# Altium project LED Project.PrjPcb
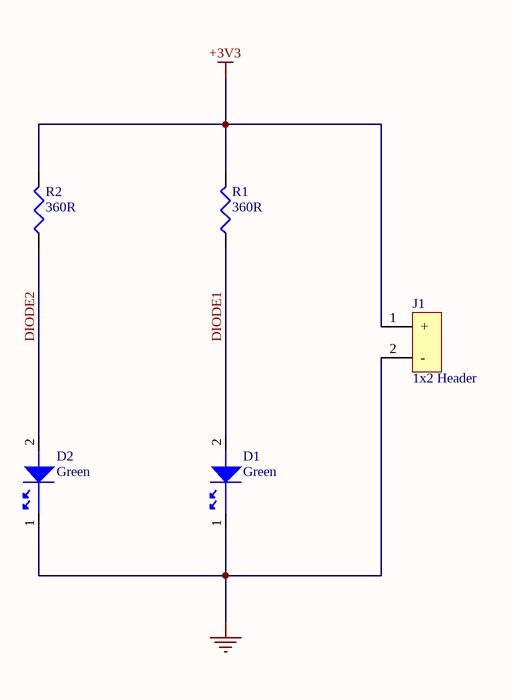
[diagram p0: LED.SchDoc]
1 sheet, 5 parts. Net scope: global (net labels, ports and power ports of the same name join across sheets).
Board file: LED.PcbDoc

## Sheet LED.SchDoc
size A; SheetNumber: 1; SheetTotal: 1

### Parts
D1  Green  [LED0603G]
D2  Green  [LED0603G]
J1  1x2 Header  [Header1x2]
R1  360R  [R0805]
R2  360R  [R0805]

### Nets
+3V3: J1.1(+) R1.2 R2.2
GND: D1.1 D2.1 J1.2(-)
DIODE1: D1.2 R1.1
DIODE2: D2.2 R2.1

### Library data of the parts
D1 D2 = APG1608CGKC/T: APG1608CGKC/T Green LED; 570 nm 1608 (0603) Clear; Rectangle Lens SMD package; Manufacturer: Kingbright; Lens Color: Colorless; Forward Voltage: 2.1V; Viewing Angle: 120°; Power Rating: 78mW; Luminous Intensity: 50mcd; Forward Current: 30mA; Test Current: 20mA; Dominant Wavelength: 570nm; Number of LEDs: 1; Parameter 1: Optoelectronic; Supplier 1: Digi-Key; Manufacturer Part Number: APG1608CGKC/T; RoHS: Yes; Category: LEDs; Stock 1: 146808; Pricing 1: 1=0.36000, 10=0.28500, 100=0.12820, 500=0.11576, 1000=0.09508, 2000=0.08268 (USD); Case/Package: 0603; Number of Pins: 2; Color: Green; Case Code (Metric): 1608; Case Code (Imperial): 0603; Min Operating Temperature: -40°C; Max Operating Temperature: 85°C; Lens Style: Clear; Package Quantity: 2000; Illumination Color: Green; Packaging: Tape and Reel; Lens Transparency: Clear; Power Dissipation: 78mW; Series: -; Length: 1.6mm; Width: 0.8mm; Height: 0.28mm; Lead Free: Lead Free; RoHS Compliant: Yes; ComponentLink1URL: https://datasheet.ciiva.com/4689/apg1608cgkc-t-76846-4689371.pdf?src-supplier=Mouser; ComponentLink1Description: https://datasheet.ciiva.com/4689/apg1608cgkc-t-76846-4689371.pdf?src-supplier=Mouser; ComponentLink2URL: https://datasheet.ciiva.com/16223/apg1608cgkc-t-16223186.pdf?src-supplier=Future+Electronics; ComponentLink2Description: https://datasheet.ciiva.com/16223/apg1608cgkc-t-16223186.pdf?src-supplier=Future+Electronics; ComponentLink3URL: https://datasheet.ciiva.com/2113/apg1608cgkc-t-2113933.pdf?src-supplier=Digi-Key; ComponentLink3Description: https://datasheet.ciiva.com/2113/apg1608cgkc-t-2113933.pdf?src-supplier=Digi-Key; ComponentLink4URL: https://datasheet.ciiva.com/2113/apg1608cgkc-t-2113934.pdf?src-supplier=Digi-Key; ComponentLink4Description: https://datasheet.ciiva.com/2113/apg1608cgkc-t-2113934.pdf?src-supplier=Digi-Key; ComponentLink5URL: https://datasheet.ciiva.com/2113/apg1608cgkc-t-2113935.pdf?src-supplier=Digi-Key; ComponentLink5Description: https://datasheet.ciiva.com/2113/apg1608cgkc-t-2113935.pdf?src-supplier=Digi-Key; ComponentLink6URL: https://datasheet.ciiva.com/14604/70062819-14604010.pdf?src-supplier=Allied+Electronics; ComponentLink6Description: https://datasheet.ciiva.com/14604/70062819-14604010.pdf?src-supplier=Allied+Electronics; Supplier Part Number 1: 754-1357-1-ND
J1 = 22-29-2021: KK 254 Wire-to-Board Header, Vertical, with Friction Lock, 2 Circuits, Gold (Au) Plating; Manufacturer: Molex; Number of Positions: 2; Connector Type: Header,Male Pin; Gender: Male; Voltage Rating (DC): 250V; Contact Post Length: 0.14inch; Glow Wire Compliant: Non-compliant; Parameter 1: Connector; Supplier 1: Digi-Key; Manufacturer Part Number: 22-29-2021; RoHS: Yes; Category: Headers and Wire Housings; Stock 1: 4686; Pricing 1: 1=0.48000, 10=0.40400, 100=0.31400, 1000=0.24671, 5000=0.21680, 10000=0.20185 (USD); Mount: Through Hole; Housing Color: Natural; Color: White; Contact Plating: Gold; Contact Material: Tin; Contact Shape: Square; Insulation Material: Nylon; Insulation Color: Natural; Max Operating Temperature: 80°C; Number of Rows: 1; Packaging: Bulk; Termination: Through Hole; Series: 6410; Contact Type: -; Package Quantity: 24000; Fastening Type: Friction; Contact Mating Length: 0.295inch; Insulation Height: 0.461inch; Lead Free: Lead Free; Halogen Free: Low Halogen; Flammability Rating: UL94 V-0; ComponentLink1URL: https://datasheet.ciiva.com/70131/022292021-sd-70131706.pdf?src-supplier=Digi-Key; ComponentLink1Description: https://datasheet.ciiva.com/70131/022292021-sd-70131706.pdf?src-supplier=Digi-Key; Supplier Part Number 1: WM2744-ND
R1 R2 = CRCW080536R0FKEA: Res Thick Film 0805 36 Ohm 1% 1/8W ±100ppm/°C Molded SMD SMD Paper T/R; Manufacturer: Vishay; Resistance: 36R; Max Power Dissipation: 125mW; Voltage Rating (DC): 150V; Parameter 1: Resistors; Supplier 1: Digi-Key; Manufacturer Part Number: CRCW080536R0FKEA; RoHS: Yes; Category: Chip SMD Resistors; Stock 1: 9532; Pricing 1: 1=0.10000, 10=0.06700, 100=0.02710, 1000=0.01219, 2500=0.01058 (USD); Case/Package: 0805; Number of Pins: 2; Case Code (Metric): 2012; Case Code (Imperial): 0805; Contact Plating: Tin; Weight: 0.000194oz; Min Operating Temperature: -55°C; Max Operating Temperature: 155°C; Tolerance: 1%; Packaging: Cut Tape; Package Quantity: 5000; Resistor Type: Thick Film; Number of Terminations: 2; Temperature Coefficient: 100ppm/°C; Features: Automotive AEC-Q200; Series: D/CRCW E3; Power Rating: 125mW; Voltage Rating: 150V; Termination: SMD/SMT; Technology: THICK FILM; Length: 2mm; Width: 1.25mm; Height: 0.45mm; Depth: 1.25mm; Lead Free: Lead Free; RoHS Compliant: Yes; REACH SVHC: Unknown; Military Standard: Not; ComponentLink1URL: https://datasheet.ciiva.com/5550/dcrcwe3-109170-5550495.pdf?src-supplier=Mouser; ComponentLink1Description: https://datasheet.ciiva.com/5550/dcrcwe3-109170-5550495.pdf?src-supplier=Mouser; ComponentLink2URL: https://datasheet.ciiva.com/5936/1697337-5936166.pdf?src-supplier=Farnell; ComponentLink2Description: https://datasheet.ciiva.com/5936/1697337-5936166.pdf?src-supplier=Farnell; ComponentLink3URL: https://datasheet.ciiva.com/9013/dcrcwe3-9013853.pdf?src-supplier=Avnet; ComponentLink3Description: https://datasheet.ciiva.com/9013/dcrcwe3-9013853.pdf?src-supplier=Avnet; ComponentLink4URL: https://datasheet.ciiva.com/2467/dcrcwe3-2467497.pdf?src-supplier=Digi-Key; ComponentLink4Description: https://datasheet.ciiva.com/2467/dcrcwe3-2467497.pdf?src-supplier=Digi-Key; ComponentLink5URL: https://datasheet.ciiva.com/2467/dcrcwe3-2467498.pdf?src-supplier=Digi-Key; ComponentLink5Description: https://datasheet.ciiva.com/2467/dcrcwe3-2467498.pdf?src-supplier=Digi-Key; ComponentLink6URL: https://datasheet.ciiva.com/2467/dcrcwe3-2467499.pdf?src-supplier=Digi-Key; ComponentLink6Description: https://datasheet.ciiva.com/2467/dcrcwe3-2467499.pdf?src-supplier=Digi-Key; ComponentLink7URL: https://datasheet.ciiva.com/26316/fld-crcw-e3-data-en-26316527.pdf?src-supplier=Distrelec; ComponentLink7Description: https://datasheet.ciiva.com/26316/fld-crcw-e3-data-en-26316527.pdf?src-supplier=Distrelec; ComponentLink8URL: https://datasheet.ciiva.com/22674/1912744-22674873.pdf?src-supplier=Element14; ComponentLink8Description: https://datasheet.ciiva.com/22674/1912744-22674873.pdf?src-supplier=Element14; ComponentLink9URL: https://datasheet.ciiva.com/22705/1697337-22705578.pdf?src-supplier=Element14; ComponentLink9Description: https://datasheet.ciiva.com/22705/1697337-22705578.pdf?src-supplier=Element14; Supplier Part Number 1: 541-36.0CCT-ND

## Assembly variants
LED2 Not Fitted: not fitted D2 R2